# Altium schematic sheet SC8815.SchDoc
size 381 x 381 mm; SheetNumber: 1; SheetTotal: 1
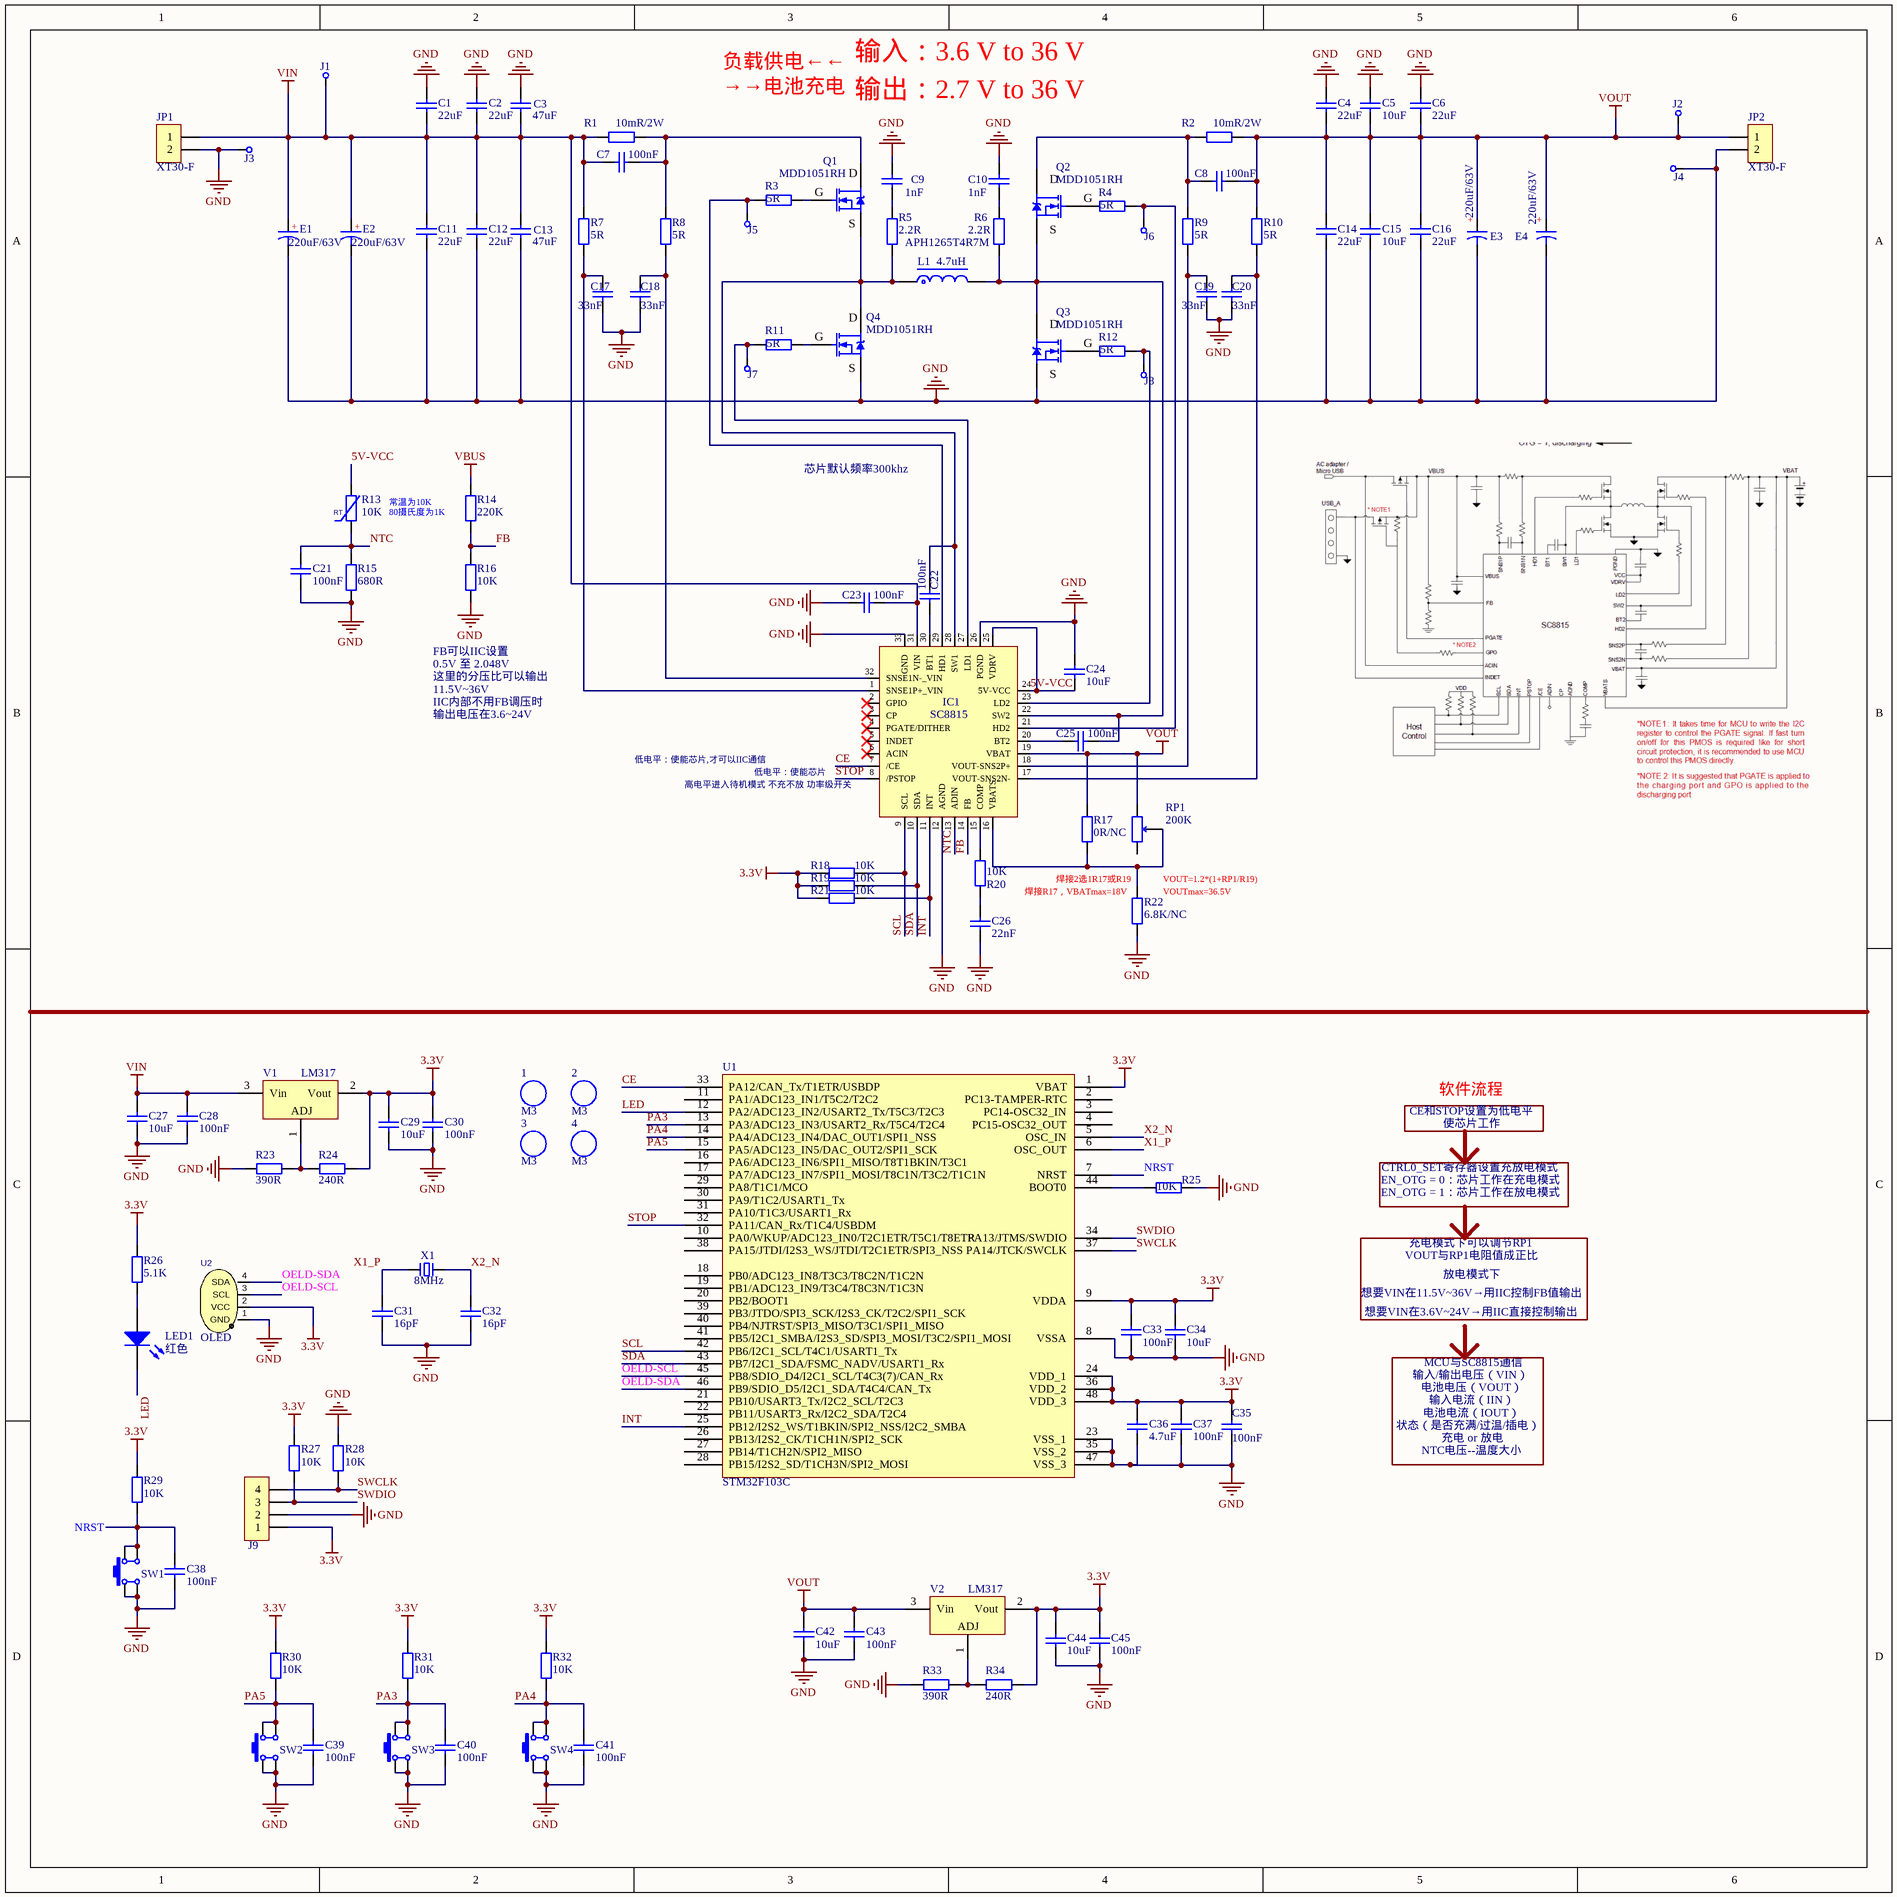
[diagram p0: SC8815.SchDoc]

## Parts
1  M3  [M3 125X200]
2  M3  [M3 125X200]
3  M3  [M3 125X200]
4  M3  [M3 125X200]
C1  22uF  [C0805_L]
C2  22uF  [C0805_L]
C3  47uF  [C0805_L]
C4  22uF  [C0805_L]
C5  10uF  [C0805_L]
C6  22uF  [C0805_L]
C7  100nF  [C0805_L]
C8  100nF  [C0805_L]
C9  1nF  [C0805_L]
C10  1nF  [C0805_L]
C11  22uF  [C0805_L]
C12  22uF  [C0805_L]
C13  47uF  [C0805_L]
C14  22uF  [C0805_L]
C15  10uF  [C0805_L]
C16  22uF  [C0805_L]
C17  33nF  [C0805_L]
C18  33nF  [C0805_L]
C19  33nF  [C0805_L]
C20  33nF  [C0805_L]
C21  100nF  [C0805_L]
C22  100nF  [C0805_L]
C23  100nF  [C0805_L]
C24  10uF  [C0805_L]
C25  100nF  [C0805_L]
C26  22nF  [C0805_L]
C27  10uF  [C0805_L]
C28  100nF  [C0805_L]
C29  10uF  [C0805_L]
C30  100nF  [C0805_L]
C31  16pF  [C0805_L]
C32  16pF  [C0805_L]
C33  100nF  [C0805_L]
C34  10uF  [C0805_L]
C35  100nF  [C0805_L]
C36  4.7uF  [C0805_L]
C37  100nF  [C0805_L]
C38  100nF  [C0805_L]
C39  100nF  [C0805_L]
C40  100nF  [C0805_L]
C41  100nF  [C0805_L]
C42  10uF  [C0805_L]
C43  100nF  [C0805_L]
C44  10uF  [C0805_L]
C45  100nF  [C0805_L]
E1  220uF/63V  [CT 5.0*10*13 - R]
E2  220uF/63V  [CT 5.0*10*13 - R]
E3  220uF/63V  [CT 5.0*10*13 - R]
E4  220uF/63V  [CT 5.0*10*13 - R]
IC1  SC8815  [QFN32_L4.0-W4.0-P0.4]
J1  CHECK  [CHECK-A]  (value not drawn)
J2  CHECK  [CHECK-A]  (value not drawn)
J3  CHECK  [CHECK-A]  (value not drawn)
J4  CHECK  [CHECK-A]  (value not drawn)
J5  CHECK  [CHECK-A]  (value not drawn)
J6  CHECK  [CHECK-A]  (value not drawn)
J7  CHECK  [CHECK-A]  (value not drawn)
J8  CHECK  [CHECK-A]  (value not drawn)
J9  HDR-1X4  [HDR2.54-LI-4P]  (value not drawn)
JP1  XT30-F  [XT30PW-F]
JP2  XT30-F  [XT30PW-F]
L1  4.7uH  [SMD,13.5x12.6mm]
LED1  红色  [LED0805_G]
Q1  MDD1051RH  [TO252]
Q2  MDD1051RH  [TO252]
Q3  MDD1051RH  [TO252]
Q4  MDD1051RH  [TO252]
R1  10mR/2W  [R2512_M]
R2  10mR/2W  [R2512_M]
R3  5R  [R0805_L]
R4  5R  [R0805_L]
R5  2.2R  [R0805_L]
R6  2.2R  [R0805_L]
R7  5R  [R0805_L]
R8  5R  [R0805_L]
R9  5R  [R0805_L]
R10  5R  [R0805_L]
R11  5R  [R0805_L]
R12  5R  [R0805_L]
R13  10K  [R0805-HP_L]
R14  220K  [R0805_L]
R15  680R  [R0805_L]
R16  10K  [R0805_L]
R17  0R/NC  [R0805_L]
R18  10K  [R0805_L]
R19  10K  [R0805_L]
R20  10K  [R0805_L]
R21  10K  [R0805_L]
R22  6.8K/NC  [R0805_L]
R23  390R  [R0805_L]
R24  240R  [R0805_L]
R25  10K  [R0805_L]
R26  5.1K  [R0805_L]
R27  10K  [R0805_L]
R28  10K  [R0805_L]
R29  10K  [R0805_L]
R30  10K  [R0805_L]
R31  10K  [R0805_L]
R32  10K  [R0805_L]
R33  390R  [R0805_L]
R34  240R  [R0805_L]
RP1  200K  [3296W]
SW1  4.5x4.5x3.8  [SW SMD-4.5*4.5*3.8]  (value not drawn)
SW2  4.5x4.5x3.8  [SW SMD-4.5*4.5*3.8]  (value not drawn)
SW3  4.5x4.5x3.8  [SW SMD-4.5*4.5*3.8]  (value not drawn)
SW4  4.5x4.5x3.8  [SW SMD-4.5*4.5*3.8]  (value not drawn)
U1  STM32F103C  [LQFP-48_M]
U2  OLED  [OLED]
V1  LM317  [SOT223_M]
V2  LM317  [SOT223_M]
X1  8MHz  [XTAL-5032-2P]

## Nets
3.3V: C29.2 C30.2 C33.2 C34.2 C35.2 C36.2 C37.2 C44.2 C45.2 J9.1 R18.1 R19.1 R21.1 R24.2 R26.1 R27.1 R29.1 R30.1 R31.1 R32.1 R34.2 U1.1(VBAT) U1.9(VDDA) U1.24(VDD_1) U1.36(VDD_2) U1.48(VDD_3) U2.2(VCC) V1.2(Vout) V2.2(Vout)
GND: C1.2 C2.2 C3.2 C4.2 C5.2 C6.2 C9.1 C10.1 C11.1 C12.1 C13.1 C14.1 C15.1 C16.1 C17.2 C18.2 C19.2 C20.2 C21.2 C23.2 C24.1 C26.2 C27.1 C28.1 C29.1 C30.1 C31.1 C32.1 C33.1 C34.1 C35.1 C36.1 C37.1 C38.1 C39.1 C40.1 C41.1 C42.1 C43.1 C44.1 C45.1 E1.2 E2.2 E3.2 E4.2 IC1.12(AGND) IC1.26(PGND) IC1.33(GND) J3.1 J4.1 J9.2 JP1.2 JP2.2 Q3.3(S) Q4.3(S) R15.2 R16.2 R22.2 R23.1 R25.2 R28.1 R33.1 SW1.1 SW1.4 SW2.1 SW2.4 SW3.1 SW3.4 SW4.1 SW4.4 U1.8(VSSA) U1.23(VSS_1) U1.35(VSS_2) U1.47(VSS_3) U2.1(GND)
VBUS: R14.1
VIN: C1.1 C2.1 C3.1 C7.2 C11.2 C12.2 C13.2 C23.1 C27.2 C28.2 E1.1 E2.1 IC1.31(VIN) J1.1 JP1.1 R1.2 R7.2 V1.3(Vin)
VOUT: C4.1 C5.1 C6.1 C8.1 C14.2 C15.2 C16.2 C42.2 C43.2 E3.1 E4.1 IC1.19(VBAT) J2.1 JP2.1 R2.1 R10.2 R17.1 RP1.3 V2.3(Vin)
5V-VCC: C24.2 IC1.24(5V-VCC) IC1.25(VDRV) R13.2
CE: IC1.7(/CE) U1.33(PA12/CAN_Tx/T1ETR/USBDP)
FB: IC1.14(FB) R14.2 R16.1
INT: IC1.11(INT) R21.2 U1.25(PB12/I2S2_WS/T1BKIN/SPI2_NSS/I2C2_SMBA)
LED: LED1.2(K) U1.12(PA2/ADC123_IN2/USART2_Tx/T5C3/T2C3)
NRST: C38.2 R29.2 SW1.2 SW1.3 U1.7(NRST)
NTC: C21.1 IC1.13(ADIN) R13.1 R15.1
OELD-SCL: U1.45(PB8/SDIO_D4/I2C1_SCL/T4C3(7)/CAN_Rx) U2.3(SCL)
OELD-SDA: U1.46(PB9/SDIO_D5/I2C1_SDA/T4C4/CAN_Tx) U2.4(SDA)
PA3: C40.2 R31.2 SW3.2 SW3.3 U1.13(PA3/ADC123_IN3/USART2_Rx/T5C4/T2C4)
PA4: C41.2 R32.2 SW4.2 SW4.3 U1.14(PA4/ADC123_IN4/DAC_OUT1/SPI1_NSS)
PA5: C39.2 R30.2 SW2.2 SW2.3 U1.15(PA5/ADC123_IN5/DAC_OUT2/SPI1_SCK)
SCL: IC1.9(SCL) R18.2 U1.42(PB6/I2C1_SCL/T4C1/USART1_Tx)
SDA: IC1.10(SDA) R19.2 U1.43(PB7/I2C1_SDA/FSMC_NADV/USART1_Rx)
STOP: IC1.8(/PSTOP) U1.32(PA11/CAN_Rx/T1C4/USBDM)
SWCLK: J9.4 R28.2 U1.37(PA14/JTCK/SWCLK)
SWDIO: J9.3 R27.2 U1.34(PA13/JTMS/SWDIO)
X1_P: C31.2 U1.6(OSC_OUT) X1.1
X2_N: C32.2 U1.5(OSC_IN) X1.2
NetC7_1: C7.1 Q1.2(D) R1.1 R8.2
NetC8_2: C8.2 Q2.2(D) R2.2 R9.2
NetC9_2: C9.2 R5.1
NetC10_2: C10.2 R6.1
NetC17_1: C17.1 IC1.1(SNSE1P+_VIN) R7.1
NetC18_1: C18.1 IC1.32(SNSE1N-_VIN) R8.1
NetC19_1: C19.1 IC1.18(VOUT-SNS2P+) R9.1
NetC20_1: C20.1 IC1.17(VOUT-SNS2N-) R10.1
NetC22_1: C22.1 IC1.28(SW1) L1.1 Q1.3(S) Q4.2(D) R5.2
NetC22_2: C22.2 IC1.30(BT1)
NetC25_1: C25.1 IC1.22(SW2) L1.2 Q2.3(S) Q3.2(D) R6.2
NetC25_2: C25.2 IC1.20(BT2)
NetC26_1: C26.1 R20.2
NetIC1_15: IC1.15(COMP) R20.1
NetIC1_16: IC1.16(VBATS) R17.2 R22.1 RP1.2
NetIC1_21: IC1.21(HD2) J6.1 R4.1
NetIC1_23: IC1.23(LD2) J8.1 R12.1
NetIC1_27: IC1.27(LD1) J7.1 R11.2
NetIC1_29: IC1.29(HD1) J5.1 R3.2
NetLED1_1: LED1.1(A) R26.2
NetQ1_1: Q1.1(G) R3.1
NetQ2_1: Q2.1(G) R4.2
NetQ3_1: Q3.1(G) R12.2
NetQ4_1: Q4.1(G) R11.1
NetR23_2: R23.2 R24.1 V1.1(ADJ)
NetR25_1: R25.1 U1.44(BOOT0)
NetR33_2: R33.2 R34.1 V2.1(ADJ)

Not connected (* = marked no-connect by the designer): IC1 2(GPIO)* 3(CP)* 4(PGATE/DITHER)* 5(INDET)* 6(ACIN)*; RP1 1; U1 2(PC13-TAMPER-RTC) 3(PC14-OSC32_IN) 4(PC15-OSC32_OUT) 10(PA0/WKUP/ADC123_IN0/T2C1ETR/T5C1/T8ETR) 11(PA1/ADC123_IN1/T5C2/T2C2) 16(PA6/ADC123_IN6/SPI1_MISO/T8T1BKIN/T3C1) 17(PA7/ADC123_IN7/SPI1_MOSI/T8C1N/T3C2/T1C1N) 18(PB0/ADC123_IN8/T3C3/T8C2N/T1C2N) 19(PB1/ADC123_IN9/T3C4/T8C3N/T1C3N) 20(PB2/BOOT1) 21(PB10/USART3_Tx/I2C2_SCL/T2C3) 22(PB11/USART3_Rx/I2C2_SDA/T2C4) 26(PB13/I2S2_CK/T1CH1N/SPI2_SCK) 27(PB14/T1CH2N/SPI2_MISO) 28(PB15/I2S2_SD/T1CH3N/SPI2_MOSI) 29(PA8/T1C1/MCO) 30(PA9/T1C2/USART1_Tx) 31(PA10/T1C3/USART1_Rx) 38(PA15/JTDI/I2S3_WS/JTDI/T2C1ETR/SPI3_NSS) 39(PB3/JTDO/SPI3_SCK/I2S3_CK/T2C2/SPI1_SCK) 40(PB4/NJTRST/SPI3_MISO/T3C1/SPI1_MISO) 41(PB5/I2C1_SMBA/I2S3_SD/SPI3_MOSI/T3C2/SPI1_MOSI)

## Notes on the sheet
- 负载供电←←
- 输入：3.6 V to 36 V
- →→电池充电
- 输出：2.7 V to 36 V
- (near R5) APH1265T4R7M
- (near R14) 常温为10K
  80摄氏度为1K
- 芯片默认频率300khz
- FB可以IIC设置
- 0.5V 至 2.048V
- 这里的分压比可以输出
- 11.5V~36V
- IIC内部不用FB调压时
- 输出电压在3.6~24V
- 低电平：使能芯片,才可以IIC通信
- 高电平进入待机模式 不充不放 功率级开关
- 低电平：使能芯片
- 焊接R17，VBATmax=18V
- 焊接2选1R17或R19
- VOUT=1.2*(1+RP1/R19)
- (near R22) VOUTmax=36.5V
- 软件流程
- CE和STOP设置为低电平
- 使芯片工作
- EN_OTG = 0：芯片工作在充电模式
- EN_OTG = 1：芯片工作在放电模式
- CTRL0_SET寄存器设置充放电模式
- VOUT与RP1电阻值成正比
- 充电模式下可以调节RP1
- 放电模式下
- 想要VIN在11.5V~36V→用IIC控制FB值输出
- 想要VIN在3.6V~24V→用IIC直接控制输出
- 输入/输出电压（VIN）
- 电池电压（VOUT）
- 电池电流（IOUT）
- MCU与SC8815通信
- 输入电流（IIN）
- 状态（是否充满/过温/插电）
- NTC电压--温度大小
- 充电 or 放电
- (in symbol CS) +

## Library data of the parts
1-4 = M3: 铜柱孔; 联系下单店铺卖家 免费技术支持: 联系下单店铺卖家 免费帮你查找封装; BOM名称: 铜柱孔
C1-C45 = C: 贴片电容/MLCC电容; BOM名称: 无极性贴片电容; 联系下单店铺卖家 免费帮你查找封装: 联系下单店铺卖家 免费技术指导
E1-E4 = CS: 直插固态电容; 联系下单店铺卖家 免费帮你查找封装: 联系下单店铺卖家 免费技术指导; 当前库版本V2025.1.5，下一版本发布时间2025年2月份 @淘宝卖家:黄晶宝石: 最新版本发布网址https://item.taobao.com/item.htm?id=566775463719; BOM名称: 直插固态电容
IC1 = SC8815: 双向同步升降压IC
J1-J8 = CHECK: 测试点
J9 = Header 4: 4P接插件; 联系卖家，免费查找封装: 唯一出售店铺网址https://shop463601444.taobao.com; 封装库来自淘宝卖家ID：黄晶宝石: 其他店铺购入均为盗版封装库，请立即申请退款，本店现金奖励50~200元; BOM名称: 4P接插件
JP1 JP2 = XT30-F: XT30母座; 当前库版本V2025.1.5，下一版本发布时间2025年2月份 @淘宝卖家:黄晶宝石: 最新版本发布网址https://item.taobao.com/item.htm?id=566775463719
L1 = L-Molding Choke: 一体成型电感; 联系下单店铺卖家 免费帮你查找封装: 联系下单店铺卖家 免费技术指导; BOM名称: 一体成型电感
LED1 = LED: 贴片LED; 封装库来自淘宝卖家：黄晶宝石: 其他店铺购入均为盗版封装库，无更新权益，请立即申请退款，本店现金奖励200~1000元; BOM名称: 贴片LED
Q1-Q4 = NCE3080: N沟道 30V/80A; BOM名称: N沟场效应管; 联系下单店铺卖家 免费帮你查找封装: 联系下单店铺卖家 免费技术支持; 当前库版本V2025.1.5，下一版本发布时间2025年2月份 @淘宝卖家:黄晶宝石: 最新版本发布网址https://item.taobao.com/item.htm?id=566775463719
R1-R12 R14-R34 = R: 贴片电阻; 联系下单店铺卖家 免费帮你查找封装: 联系下单店铺卖家 免费技术指导; BOM名称: 贴片电阻
R13 = RT: 热敏电阻; BOM名称: 压敏电阻; 当前库版本V2025.1.5，下一版本发布时间2025年2月份 @淘宝卖家:黄晶宝石: 最新版本发布网址https://item.taobao.com/item.htm?id=566775463719
RP1 = RP: 单联电位器; BOM名称: 插件电位器; 联系下单店铺卖家 免费帮你查找封装: 联系下单店铺卖家 免费技术指导
SW1-SW4 = SW SMD-4.5x4.5: 贴片4.5x4.5轻触开关; BOM名称: 贴片4x4轻触开关; 联系下单店铺卖家 免费技术支持: 联系下单店铺卖家 免费帮你查找封装
U1 = STM32F103C: STM32单片机48引脚
U2 = OLED: 0.96OLED; Symbol: HS96L03W2C03
V1 V2 = LM317: 可调线性稳压芯片; 当前库版本V2025.1.5，下一版本发布时间2025年2月份 @淘宝卖家:黄晶宝石: 最新版本发布网址https://item.taobao.com/item.htm?id=566775463719; BOM名称: 可调线性稳压芯片
X1 = XTAL-2P: 2脚无源晶振(谐振器）; 联系下单店铺卖家 免费帮你查找封装: 联系下单店铺卖家 免费技术指导; BOM名称: 2脚无源晶振(谐振器）